# Altium schematic sheet IR_Sensor_Block.SchDoc
size A4; SheetNumber: 6; SheetTotal: 7
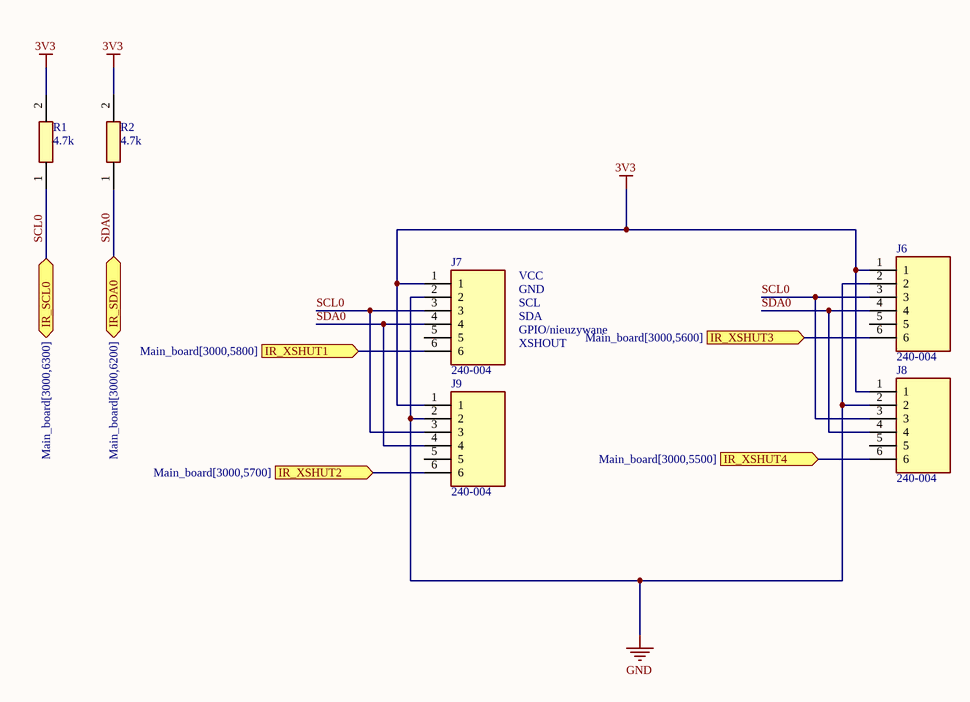
[diagram p0: IR_Sensor_Block.SchDoc]

## Parts
J6  240-004  [HDRV6W64P0X254_1X6_1524X254X909P]
J7  240-004  [HDRV6W64P0X254_1X6_1524X254X909P]
J8  240-004  [HDRV6W64P0X254_1X6_1524X254X909P]
J9  240-004  [HDRV6W64P0X254_1X6_1524X254X909P]
R1  4.7k  [RESC1608X55N]
R2  4.7k  [RESC1608X55N]

## Ports
IR_SCL0 (bidir, see Main_board[3000,6300]), IR_SDA0 (bidir, see Main_board[3000,6200]), IR_XSHUT1 (in, see Main_board[3000,5800]), IR_XSHUT2 (in, see Main_board[3000,5700]), IR_XSHUT3 (in, see Main_board[3000,5600]), IR_XSHUT4 (in, see Main_board[3000,5500])

## Nets
3V3: J6.1 J7.1 J8.1 J9.1 R1.2 R2.2
GND: J6.2 J7.2 J8.2 J9.2
IR_XSHUT1: J7.6 ; port IR_XSHUT1
IR_XSHUT2: J9.6 ; port IR_XSHUT2
IR_XSHUT3: J6.6 ; port IR_XSHUT3
IR_XSHUT4: J8.6 ; port IR_XSHUT4
SCL0: J6.3 J7.3 J8.3 J9.3 R1.1 ; port IR_SCL0
SDA0: J6.4 J7.4 J8.4 J9.4 R2.1 ; port IR_SDA0

Not connected (* = marked no-connect by the designer): J6 5; J7 5; J8 5; J9 5

## Notes on the sheet
- VCC
- GND
- SCL
- SDA
- GPIO/nieuzywane
- XSHOUT

## Library data of the parts
J6-J9 = 240-004: Connector; Manufacturer_Name: Digilent; Datasheet Link: https://digilent.com/reference/_media/reference/test-and-measurement/6-pin-header-gender-changer/163-068-2.pdf; Height: 9.09mm; Manufacturer_Part_Number: 240-004; Arrow Part Number: 240-004; Arrow Price/Stock: https://www.arrow.com/en/products/240-004/digilent?utm_currency=USD&region=nac
R1 R2 = RMCF0603FT4K70: Resistor; Manufacturer_Name: Stackpole Electronics; Datasheet Link: https://www.seielect.com/Catalog/SEI-RMCF_RMCP.pdf; Height: 0.55mm; Manufacturer_Part_Number: RMCF0603FT4K70; Mouser Part Number: 708-RMCF0603FT4K70; Mouser Price/Stock: https://www.mouser.co.uk/ProductDetail/SEI-Stackpole/RMCF0603FT4K70?qs=FESYatJ8odI8oUfeKfwCJw%3D%3D; Arrow Part Number: RMCF0603FT4K70; Arrow Price/Stock: https://www.arrow.com/en/products/rmcf0603ft4k70/stackpole-electronics?utm_currency=USD&region=nac